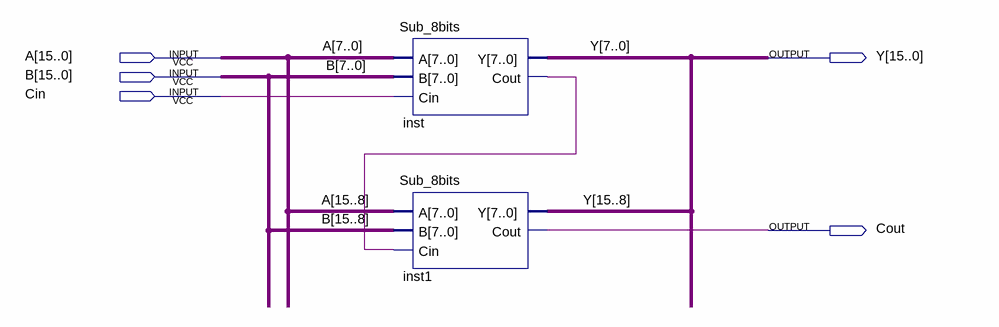
[diagram p0: schematic sheet]
// Quartus schematic Sub_16bits.bdf as structural Verilog: 2 symbols, 5 pins
module Sub_16bits (
  input  [15:0] A,
  input  [15:0] B,
  input  Cin,
  output [15:0] Y,
  output Cout
);

  wire inst_cout;

  Sub_8bits inst (.A(A[7:0]), .B(B[7:0]), .Cin(Cin), .Y(Y[7:0]), .Cout(inst_cout));
  Sub_8bits inst1 (.A(A[15:8]), .B(B[15:8]), .Cin(inst_cout), .Y(Y[15:8]), .Cout(Cout));
endmodule
